# Altium schematic sheet DMD_Card_Microcontroller.SchDoc
size A3; DrawnBy: Hanif; Organization: AFRA Technology; DocumentNumber: 1; SheetNumber: 1; SheetTotal: 2
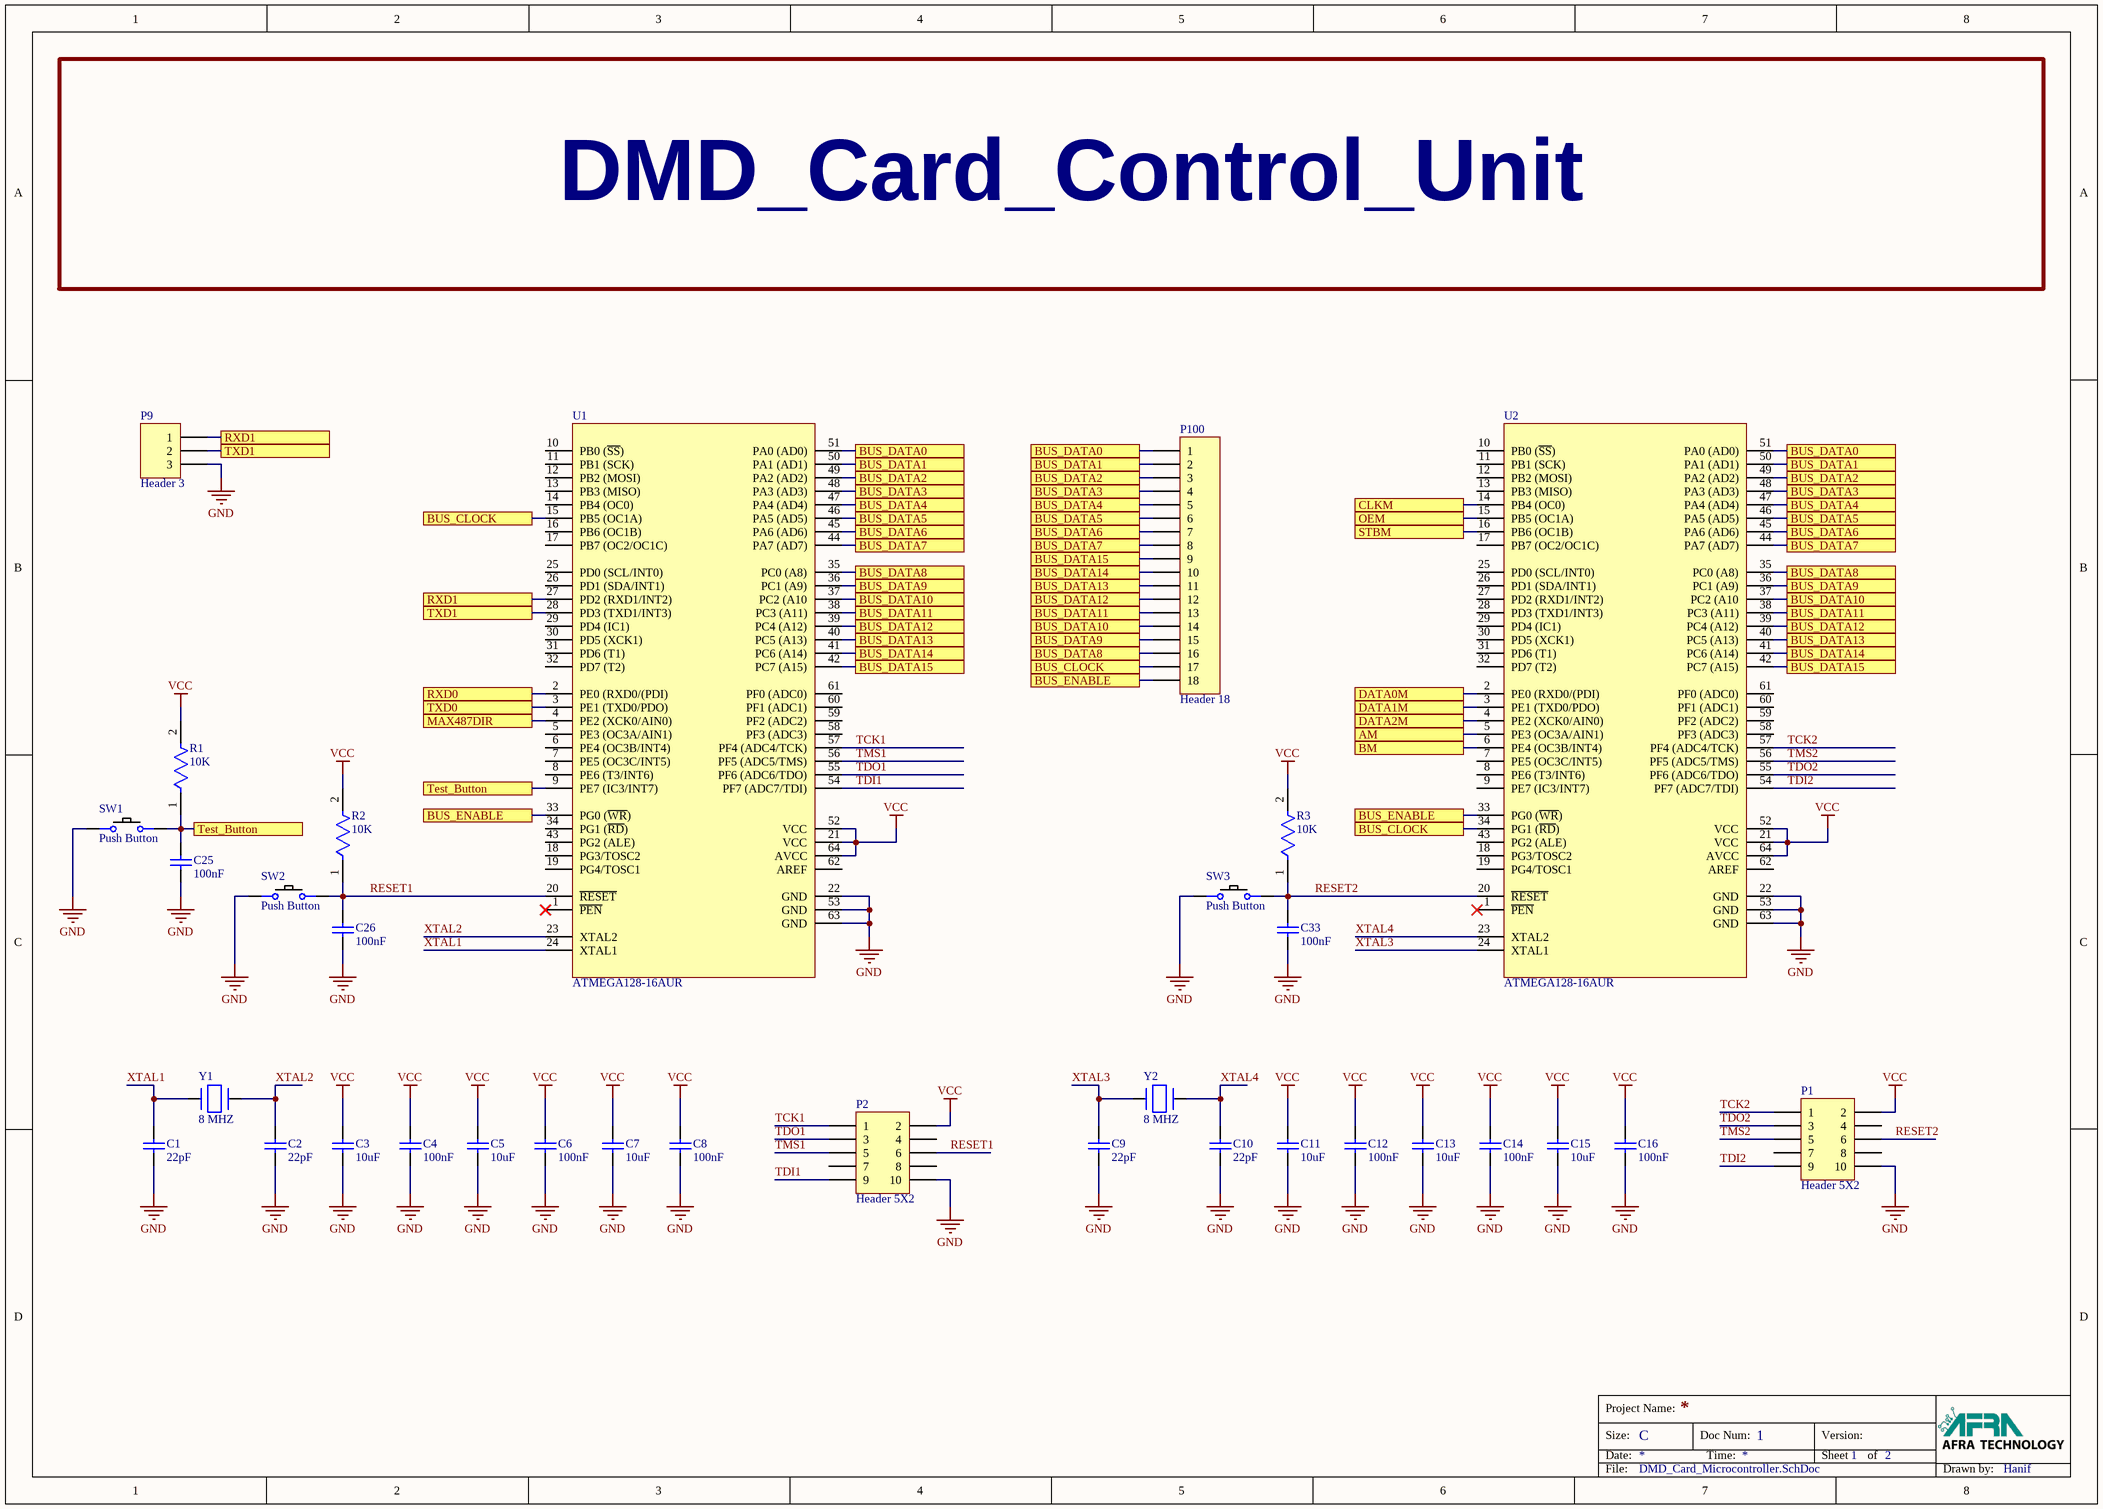
[diagram p0: DMD_Card_Microcontroller.SchDoc]

## Parts
C1  22pF  [Yageo_CC1206-1.25_IPC_A]
C2  22pF  [Yageo_CC1206-1.25_IPC_A]
C3  10uF  [Yageo_CC1206-1.25_IPC_A]
C4  100nF  [Yageo_CC1206-1.25_IPC_A]
C5  10uF  [Yageo_CC1206-1.25_IPC_A]
C6  100nF  [Yageo_CC1206-1.25_IPC_A]
C7  10uF  [Yageo_CC1206-1.25_IPC_A]
C8  100nF  [Yageo_CC1206-1.25_IPC_A]
C9  22pF  [Yageo_CC1206-1.25_IPC_A]
C10  22pF  [Yageo_CC1206-1.25_IPC_A]
C11  10uF  [Yageo_CC1206-1.25_IPC_A]
C12  100nF  [Yageo_CC1206-1.25_IPC_A]
C13  10uF  [Yageo_CC1206-1.25_IPC_A]
C14  100nF  [Yageo_CC1206-1.25_IPC_A]
C15  10uF  [Yageo_CC1206-1.25_IPC_A]
C16  100nF  [Yageo_CC1206-1.25_IPC_A]
C25  100nF  [Yageo_CC1206-1.25_IPC_A]
C26  100nF  [Yageo_CC1206-1.25_IPC_A]
C33  100nF  [Yageo_CC1206-1.25_IPC_A]
P1  Header 5X2  [HDR2X5]
P2  Header 5X2  [HDR2X5]
P9  Header 3  [HDR1X3]
P100  Header 18  [HDR1X18]
R1  10K  [Yageo_RT1206_IPC_A]
R2  10K  [Yageo_RT1206_IPC_A]
R3  10K  [Yageo_RT1206_IPC_A]
SW1  Push Button  [Tactile Switch SPST]
SW2  Push Button  [Tactile Switch SPST]
SW3  Push Button  [Tactile Switch SPST]
U1  ATMEGA128-16AUR  [64-TQFP]
U2  ATMEGA128-16AUR  [64-TQFP]
Y1  8 MHZ  [CTS_ATS080B_0]
Y2  8 MHZ  [CTS_ATS080B_0]

## Ports
AM, BM, BUS_CLOCK, BUS_DATA0, BUS_DATA1, BUS_DATA2, BUS_DATA3, BUS_DATA4, BUS_DATA5, BUS_DATA6, BUS_DATA7, BUS_DATA8, BUS_DATA9, BUS_DATA10, BUS_DATA11, BUS_DATA12, BUS_DATA13, BUS_DATA14, BUS_DATA15, BUS_ENABLE, CLKM, DATA0M, DATA1M, DATA2M, MAX487DIR, OEM, RXD0, RXD1, STBM, Test_Button, TXD0, TXD1

## Nets
GND: C1.1 C2.1 C3.1 C4.1 C5.1 C6.1 C7.1 C8.1 C9.1 C10.1 C11.1 C12.1 C13.1 C14.1 C15.1 C16.1 C25.1 C26.1 C33.1 P1.10 P2.10 P9.3 SW1.1,2 SW2.1,2 SW3.1,2 U1.22(GND) U1.53(GND) U1.63(GND) U2.22(GND) U2.53(GND) U2.63(GND)
VCC: C3.2 C4.2 C5.2 C6.2 C7.2 C8.2 C11.2 C12.2 C13.2 C14.2 C15.2 C16.2 P1.2 P2.2 R1.2 R2.2 R3.2 U1.21(VCC) U1.52(VCC) U1.64(AVCC) U2.21(VCC) U2.52(VCC) U2.64(AVCC)
AM: U2.5(PE3_(OC3A/AIN1)) ; port AM
BM: U2.6(PE4_(OC3B/INT4)) ; port BM
BUS_CLOCK: P100.17 U1.15(PB5_(OC1A)) U2.34(PG1_(~{RD})) ; port BUS_CLOCK
BUS_DATA0: P100.1 U1.51(PA0_(AD0)) U2.51(PA0_(AD0)) ; port BUS_DATA0
BUS_DATA1: P100.2 U1.50(PA1_(AD1)) U2.50(PA1_(AD1)) ; port BUS_DATA1
BUS_DATA2: P100.3 U1.49(PA2_(AD2)) U2.49(PA2_(AD2)) ; port BUS_DATA2
BUS_DATA3: P100.4 U1.48(PA3_(AD3)) U2.48(PA3_(AD3)) ; port BUS_DATA3
BUS_DATA4: P100.5 U1.47(PA4_(AD4)) U2.47(PA4_(AD4)) ; port BUS_DATA4
BUS_DATA5: P100.6 U1.46(PA5_(AD5)) U2.46(PA5_(AD5)) ; port BUS_DATA5
BUS_DATA6: P100.7 U1.45(PA6_(AD6)) U2.45(PA6_(AD6)) ; port BUS_DATA6
BUS_DATA7: P100.8 U1.44(PA7_(AD7)) U2.44(PA7_(AD7)) ; port BUS_DATA7
BUS_DATA8: P100.16 U1.35(PC0_(A8)) U2.35(PC0_(A8)) ; port BUS_DATA8
BUS_DATA9: P100.15 U1.36(PC1_(A9)) U2.36(PC1_(A9)) ; port BUS_DATA9
BUS_DATA10: P100.14 U1.37(PC2_(A10) U2.37(PC2_(A10) ; port BUS_DATA10
BUS_DATA11: P100.13 U1.38(PC3_(A11)) U2.38(PC3_(A11)) ; port BUS_DATA11
BUS_DATA12: P100.12 U1.39(PC4_(A12)) U2.39(PC4_(A12)) ; port BUS_DATA12
BUS_DATA13: P100.11 U1.40(PC5_(A13)) U2.40(PC5_(A13)) ; port BUS_DATA13
BUS_DATA14: P100.10 U1.41(PC6_(A14)) U2.41(PC6_(A14)) ; port BUS_DATA14
BUS_DATA15: P100.9 U1.42(PC7_(A15)) U2.42(PC7_(A15)) ; port BUS_DATA15
BUS_ENABLE: P100.18 U1.33(PG0_(~{WR})) U2.33(PG0_(~{WR})) ; port BUS_ENABLE
CLKM: U2.14(PB4_(OC0)) ; port CLKM
DATA0M: U2.2(PE0_(RXD0/(PDI)) ; port DATA0M
DATA1M: U2.3(PE1_(TXD0/PDO)) ; port DATA1M
DATA2M: U2.4(PE2_(XCK0/AIN0)) ; port DATA2M
MAX487DIR: U1.4(PE2_(XCK0/AIN0)) ; port MAX487DIR
OEM: U2.15(PB5_(OC1A)) ; port OEM
RESET1: C26.2 P2.6 R2.1 SW2.3,4 U1.20(~{RESET})
RESET2: C33.2 P1.6 R3.1 SW3.3,4 U2.20(~{RESET})
RXD0: U1.2(PE0_(RXD0/(PDI)) ; port RXD0
RXD1: P9.1 U1.27(PD2_(RXD1/INT2)) ; port RXD1
STBM: U2.16(PB6_(OC1B)) ; port STBM
TCK1: P2.1 U1.57(PF4_(ADC4/TCK))
TCK2: P1.1 U2.57(PF4_(ADC4/TCK))
TDI1: P2.9 U1.54(PF7_(ADC7/TDI))
TDI2: P1.9 U2.54(PF7_(ADC7/TDI))
TDO1: P2.3 U1.55(PF6_(ADC6/TDO))
TDO2: P1.3 U2.55(PF6_(ADC6/TDO))
Test_Button: C25.2 R1.1 SW1.3,4 U1.9(PE7_(IC3/INT7)) ; port Test_Button
TMS1: P2.5 U1.56(PF5_(ADC5/TMS))
TMS2: P1.5 U2.56(PF5_(ADC5/TMS))
TXD0: U1.3(PE1_(TXD0/PDO)) ; port TXD0
TXD1: P9.2 U1.28(PD3_(TXD1/INT3)) ; port TXD1
XTAL1: C1.2 U1.24(XTAL1) Y1.1
XTAL2: C2.2 U1.23(XTAL2) Y1.2
XTAL3: C9.2 U2.24(XTAL1) Y2.1
XTAL4: C10.2 U2.23(XTAL2) Y2.2

Not connected (* = marked no-connect by the designer): P1 4 7 8; P2 4 7 8; U1 1(~{PEN})* 5(PE3_(OC3A/AIN1)) 6(PE4_(OC3B/INT4)) 7(PE5_(OC3C/INT5)) 8(PE6_(T3/INT6)) 10(PB0_(~{SS})) 11(PB1_(SCK)) 12(PB2_(MOSI)) 13(PB3_(MISO)) 14(PB4_(OC0)) 16(PB6_(OC1B)) 17(PB7_(OC2/OC1C)) 18(PG3/TOSC2) 19(PG4/TOSC1) 25(PD0_(SCL/INT0)) 26(PD1_(SDA/INT1)) 29(PD4_(IC1)) 30(PD5_(XCK1)) 31(PD6_(T1)) 32(PD7_(T2)) 34(PG1_(~{RD})) 43(PG2_(ALE)) 58(PF3_(ADC3)) 59(PF2_(ADC2)) 60(PF1_(ADC1)) 61(PF0_(ADC0)) 62(AREF); U2 1(~{PEN})* 7(PE5_(OC3C/INT5)) 8(PE6_(T3/INT6)) 9(PE7_(IC3/INT7)) 10(PB0_(~{SS})) 11(PB1_(SCK)) 12(PB2_(MOSI)) 13(PB3_(MISO)) 17(PB7_(OC2/OC1C)) 18(PG3/TOSC2) 19(PG4/TOSC1) 25(PD0_(SCL/INT0)) 26(PD1_(SDA/INT1)) 27(PD2_(RXD1/INT2)) 28(PD3_(TXD1/INT3)) 29(PD4_(IC1)) 30(PD5_(XCK1)) 31(PD6_(T1)) 32(PD7_(T2)) 43(PG2_(ALE)) 58(PF3_(ADC3)) 59(PF2_(ADC2)) 60(PF1_(ADC1)) 61(PF0_(ADC0)) 62(AREF)

## Notes on the sheet
- DMD_Card_Control_Unit
- Project Name:
- Size:
- Date:
- C
- Doc Num:
- Time:
- Version:
- Sheet
- of
- File:
- Drawn by:

## Library data of the parts
C1 C2 C9 C10 = CC1206JRNP09BN220: CAP 22pF 50V ±5% 1206 (3216 Metric) Thickness 0.75mm SMD; Tolerance: Â±5%; Case-Metric: 3216; Case-EIA: 1206; Max Thickness: 0.75 mm; Rated Voltage: 50 V; Value: 22pF; Technology: SMT; PartNumber: CC1206JRNP09BN220
C3 C5 C7 C11 C13 C15 = CC1206KRX7R7BB334
C4 C6 C8 C12 C14 C16 C25 C26 C33 = CC1206KRX7R7BB104
P1 P2 = Header 5X2: Header, 5-Pin, Dual row; LatestRevisionDate: 17-Jul-2002; LatestRevisionNote: Re-released for DXP Platform.; Publisher: Altium Limited
P9 = Header 3: Header, 3-Pin; LatestRevisionDate: 17-Jul-2002; LatestRevisionNote: Re-released for DXP Platform.; Publisher: Altium Limited
P100 = Header 18: Header, 18-Pin; LatestRevisionDate: 17-Jul-2002; LatestRevisionNote: Re-released for DXP Platform.; Publisher: Altium Limited
R1-R3 = RT1206BRD0710KL
SW1-SW3 = PTS526SKG15SMTR2LFS: Switch Tactile N.O. SPST Round Button Gull Wing 0.05A 12VDC 200000Cycles 2.45N SMD T/R; Manufacturer: ITT C&K; Supplier 1: Digi-Key; Manufacturer Part Number: PTS526SKG15SMTR2LFS; RoHS: No; Category: Tactile Switches; Stock 1: 7554; Pricing 1: 1=0.13000, 10=0.12100, 25=0.11480, 100=0.10430, 250=0.09808, 500=0.08972, 1000=0.07511 (USD); Supplier Part Number 1: CKN12223-1-ND
U1 U2 = ATMEGA128-16AUR: 8-bit AVR Microcontroller, 4.5-5.5V, 128KB Flash, 4KB EEPROM, 4KB SRAM, 64-pin TQFP, Industrial Grade (-40°C to 85°C), Reel; ComponentLink1Description: Manufacturer URL; ComponentLink2Description: ATmega128(L) Datasheet; DatasheetVersion: revX, Jun-2011; ComponentLink3URL: http://www.atmel.com/dyn/resources/prod_documents/2467S.pdf; ComponentLink3Description: ATmega128(L) Summary; ComponentLink1URL: http://www.atmel.com/; Code_JEDEC: MS-026-AEB; PackageVersion: revC, Oct-2010; PackageDescription: 64-Pin Plastic Thin Profile Quad Flat Pack, 14 x 14 x 1.0 mm Body, 0.8 mm Pitch (TQFP); ComponentLink2URL: http://www.atmel.com/dyn/resources/prod_documents/doc2467.pdf; PackageReference: 64A; PartNumber: ATMEGA128-16AUR
Y1 Y2 = CRYSTAL 8.000MHZ: CRYSTAL 8.000MHZ 20PF THRU; Manufacturer: TXC; Manufacturer Part Number: 9B-8.000MBBK-B; Frequency Stability: 50ppm; Frequency: 8MHz; ESR (Equivalent Series Resistance): 80R; Supplier 1: Digi-Key; RoHS: Yes; Category: Crystals; Pricing 1: 1000=0.16000 (USD); Mount: Through Hole; Case/Package: Metal; Min Operating Temperature: -20°C; Max Operating Temperature: 70°C; Package Quantity: 1000; Frequency Tolerance: 50ppm; Load Capacitance: 20pF; Packaging: Bulk; Length: 0.453inch; Width: 0.197inch; Height: 0.145inch; ComponentLink1URL: https://datasheet.ciiva.com/6733/9b-6733750.pdf?src-supplier=Digi-Key; ComponentLink1Description: https://datasheet.ciiva.com/6733/9b-6733750.pdf?src-supplier=Digi-Key; ComponentLink2URL: https://datasheet.ciiva.com/29631/9b-29631174.pdf?src-supplier=Digi-Key; ComponentLink2Description: https://datasheet.ciiva.com/29631/9b-29631174.pdf?src-supplier=Digi-Key; Supplier Part Number 1: 887-2033-ND